# EAGLE schematic duende_with_footswitch (EAGLE 7.3.0)
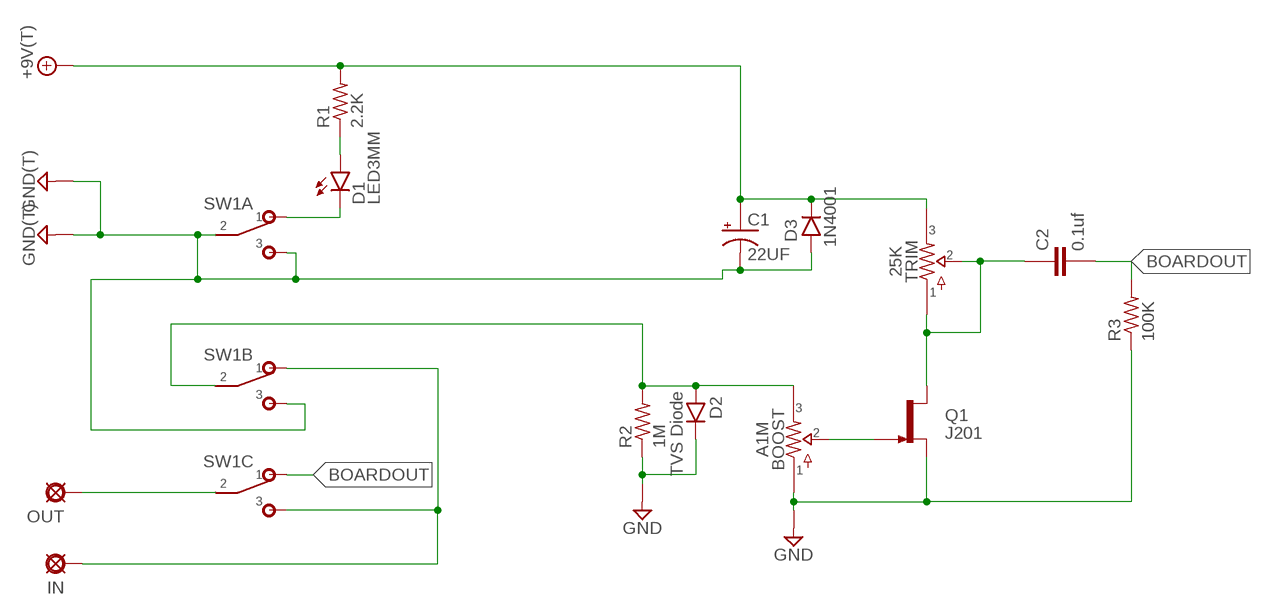
[diagram p0: schematic, sheet 1]

## Parts
+9V  +9V(T)  [SQUARE]
BOOST  A1M  POTSSMALL_PADS  [PADS_SMALL]
C1  22UF  0501  [050_020_1]
C2  0.1uf  072X0252  [072X025]
D1  LED3MM  [LED3MM]
D2  TVS Diode  1N400X.2  [DO41-2]
D3  1N4001  1N400X.2  [DO41-2]
GND  GND(T)  [SQUARE]
GND1  GND(T)  [SQUARE]
IN  PADO  [ROUND]
OUT  PADO  [ROUND]
Q1  J201  [TO92-]
R1  2.2K  6MM.3  [R0207/3]
R2  1M  6MM.3  [R0207/3]
R3  100K  6MM.3  [R0207/3]
SW1  3PDT  [3PDT]
TRIM  25K  POTSTRIM  [TRIM-ALL]

## Nets
+9V: +9V.1(+9V) C1.+ D3.C R1.2 TRIM.3 TRIM.6
BOARDIN: BOOST.3 D2.A R2.2 SW1.B2
BOARDOUT: C2.2 R3.2 SW1.C1
GND: BOOST.1 C1.- D2.C D3.A GND1.1(GND) GND.1(GND) Q1.2(S) R2.1 R3.1 SW1.A2 SW1.A3 SW1.B3
INPUT: IN.1(PAD) SW1.B1 SW1.C3
N$3: D1.K(C) SW1.A1
N$4: D1.A R1.1
N$6: BOOST.2 Q1.1(G)
N$7: C2.1 Q1.3(D) TRIM.1 TRIM.2 TRIM.4 TRIM.5
OUTPUT: OUT.1(PAD) SW1.C2

## Library data of the parts
+9V = kdd-supply:+9V(T): +9V Voltage Supply use this to hook up +9v throughout a schematic instead of running wire automatically labels the net "+9v" adds a hookup pad to the circuit board
BOOST TRIM = kdd-mb-pots:POTS
C1 = kdd-caps-electro-pol:050: 0.22 - 100uF Xicon values at Mouser.com: 10V: 10 - 100uF; 16V: 2.2 - 47uF; 25V: 0.47 - 47uF; 50V: 0.22 - 22uF
C2 = kdd-caps-film-box:072X025: 1000pF - 0.47uF WIMA MKP2 63, 100V: 1000pF - 0.015uF; MKS2 50V: 0.33 - 0.47uF; 63V: 1000pF - 0.22uF;
D1 = kdd-diodes:LED
D2 D3 = kdd-diodes:1N400X: Rectifier Diodes often used in power supply to prevent damage from reverse polarization
GND GND1 = kdd-supply:GND(T): Ground use this to hook up ground (GND) throughout a schematic instead of running wire automatically labels the net "GND" adds a hookup pad to the circuit board (you can use several)
IN OUT = kdd-supply:PAD: PAD use this package for pads with any purpose, including input, output, send or return various pad shapes: round, square, octogonal, long, and long offset
Q1 = kdd-trans:J201: N-channel JFET
R1-R3 = kdd-resistors:6MM: 6mm Resistors Leads spaced 1-6 holes apart for 0.1" perfboard. Suitable for 1/4 watt resistors.
SW1 = kdd-mb-switches:3PDT

## Net classes
0 default: width 0.508 mm, clearance 0.508 mm